# Altium schematic sheet External interfaces and connections.SchDoc
size A4; SheetNumber: 10; SheetTotal: 10
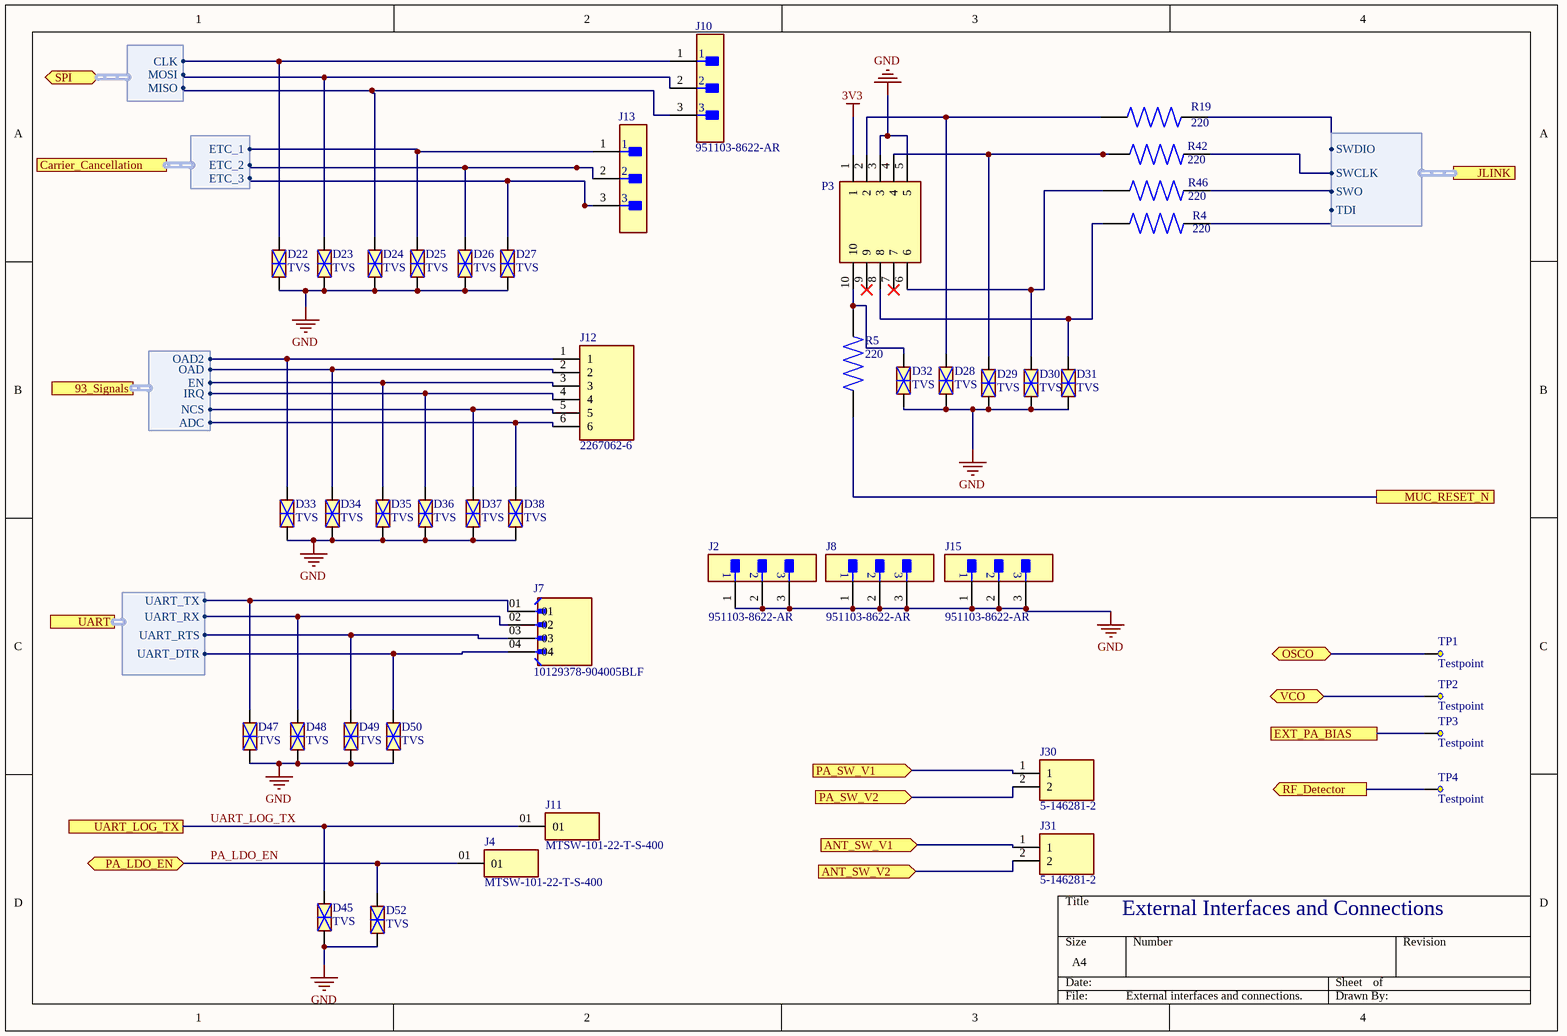
[diagram p0: External interfaces and connections.SchDoc]

## Parts
D22  TVS  [ST0201]
D23  TVS  [ST0201]
D24  TVS  [ST0201]
D25  TVS  [ST0201]
D26  TVS  [ST0201]
D27  TVS  [ST0201]
D28  TVS  [ST0201]
D29  TVS  [ST0201]
D30  TVS  [ST0201]
D31  TVS  [ST0201]
D32  TVS  [ST0201]
D33  TVS  [ST0201]
D34  TVS  [ST0201]
D35  TVS  [ST0201]
D36  TVS  [ST0201]
D37  TVS  [ST0201]
D38  TVS  [ST0201]
D45  TVS  [ST0201]
D47  TVS  [ST0201]
D48  TVS  [ST0201]
D49  TVS  [ST0201]
D50  TVS  [ST0201]
D52  TVS  [ST0201]
J2  951103-8622-AR  [FP-951103-8622-AR-MFG]
J4  MTSW-101-22-T-S-400  [SAMTEC_MTSW-101-22-T-S-400]
J7  10129378-904005BLF  [AMPHENOL_10129378-904005BLF]
J8  951103-8622-AR  [FP-951103-8622-AR-MFG]
J10  951103-8622-AR  [FP-951103-8622-AR-MFG]
J11  MTSW-101-22-T-S-400  [SAMTEC_MTSW-101-22-T-S-400]
J12  2267062-6  [TE_2267062-6]
J13  951103-8622-AR  [FP-951103-8622-AR-MFG]  (value not drawn)
J15  951103-8622-AR  [FP-951103-8622-AR-MFG]
J30  5-146281-2  [TE_5-146281-2]
J31  5-146281-2  [TE_5-146281-2]
P3  .06.04_J-LINK_NEEDLE_ADAPTER  [SEGGER_8.06.04_J-LINK_NEEDLE_ADAPTER]  (value not drawn)
R4  220  [RESC1005X40N]
R5  220  [RESC1005X40N]
R19  220  [RESC1005X40N]
R42  220  [RESC1005X40N]
R46  220  [RESC1005X40N]
TP1  Testpoint  [Testpoint_FP]
TP2  Testpoint  [Testpoint_FP]
TP3  Testpoint  [Testpoint_FP]
TP4  Testpoint  [Testpoint_FP]

## Ports
93_Signals (harness 93_Signals, see System Overview[1B], Microcontroller[4A], UHF RFID READER IC[1A]), ANT_SW_V1 (in, see System Overview[1D], Antenna Switch[2B], Microcontroller[1C]), ANT_SW_V2 (in, see System Overview[1D], Antenna Switch[2B], Microcontroller[1C]), Carrier_Cancellation (harness Carrier_Cancellation, see System Overview[1B], Carrier Cancellation Circuit[1A], Microcontroller[4B]), EXT_PA_BIAS (see System Overview[1C], External Power Amplifier[1C]), JLINK (harness JLINK, see System Overview[1C], Microcontroller[1B]), MUC_RESET_N (see System Overview[1C], Microcontroller[3B]), OSCO (bidir, see System Overview[1C], UHF RFID READER IC[1B]), PA_LDO_EN (bidir, see System Overview[1C], Microcontroller[1B], Supply LDOs[2C]), PA_SW_V1 (in, see System Overview[1C], External Power Amplifier[4A], Microcontroller[1B]), PA_SW_V2 (in, see System Overview[1C], External Power Amplifier[4A], Microcontroller[3A]), RF_Detector (out, see System Overview[1C], External Power Amplifier[3D], Microcontroller[2A]), SPI (bidir, harness SPI, see System Overview[1B], Carrier Cancellation Circuit[1A], Microcontroller[4A], UHF RFID READER IC[1A]), UART (harness UART, see System Overview[1C], Microcontroller[1A], USB suply_UART bridge[4D]), UART_LOG_TX (see System Overview[1C], Microcontroller[4A]), VCO (bidir, see System Overview[1C], UHF RFID READER IC[1B])

## Harnesses
93_Signals: EN, IRQ, NCS, ADC, OAD, OAD2
Carrier_Cancellation: ETC_1, ETC_2, ETC_3
SPI: CLK, MISO, MOSI
UART: UART_TX, UART_RX, UART_RTS, UART_DTR
JLINK: SWDIO, SWCLK, SWO, TDI

## Nets
3V3: P3.1
GND: D22.2 D23.2 D24.2 D25.2 D26.2 D27.2 D28.2 D29.1 D29.2 D30.2 D31.2 D32.2 D33.2 D34.2 D35.2 D36.2 D37.2 D38.2 D45.2 D47.2 D48.2 D49.2 D50.2 D52.2 J2.1 J2.2 J2.3 J8.1 J8.2 J8.3 J15.1 J15.2 J15.3 P3.3 P3.4 P3.5 R42.1
ANT_SW_V1: J31.1 ; port ANT_SW_V1
ANT_SW_V2: J31.2 ; port ANT_SW_V2
EXT_PA_BIAS: TP3.TP?(Testpoint) ; port EXT_PA_BIAS
MUC_RESET_N: R5.1 ; port MUC_RESET_N
OSCO: TP1.TP?(Testpoint) ; port OSCO
PA_LDO_EN: D52.1 J4.01 ; port PA_LDO_EN
PA_SW_V1: J30.1 ; port PA_SW_V1
PA_SW_V2: J30.2 ; port PA_SW_V2
RF_Detector: TP4.TP?(Testpoint) ; port RF_Detector
UART_LOG_TX: D45.1 J11.01 ; port UART_LOG_TX
VCO: TP2.TP?(Testpoint) ; port VCO
NetD22_1: D22.1 J10.1 ; port SPI.CLK
NetD23_1: D23.1 J10.2 ; port SPI.MOSI
NetD24_1: D24.1 J10.3 ; port SPI.MISO
NetD25_1: D25.1 J13.1 ; port Carrier_Cancellation.ETC_1
NetD26_1: D26.1 J13.2 ; port Carrier_Cancellation.ETC_2
NetD27_1: D27.1 J13.3 ; port Carrier_Cancellation.ETC_3
NetD28_1: D28.1 P3.2 R19.1
NetD30_1: D30.1 P3.6 R46.1
NetD31_1: D31.1 P3.8 R4.1
NetD32_1: D32.1 P3.10 R5.2
NetD33_1: D33.1 J12.1 ; port 93_Signals.OAD2
NetD34_1: D34.1 J12.2 ; port 93_Signals.OAD
NetD35_1: D35.1 J12.3 ; port 93_Signals.EN
NetD36_1: D36.1 J12.4 ; port 93_Signals.IRQ
NetD37_1: D37.1 J12.5 ; port 93_Signals.NCS
NetD38_1: D38.1 J12.6 ; port 93_Signals.ADC
NetD47_1: D47.1 J7.01 ; port UART.UART_TX
NetD48_1: D48.1 J7.02 ; port UART.UART_RX
NetD49_1: D49.1 J7.03 ; port UART.UART_RTS
NetD50_1: D50.1 J7.04 ; port UART.UART_DTR
NetR4_2: R4.2 ; port JLINK.TDI
NetR19_2: R19.2 ; port JLINK.SWDIO
NetR42_2: R42.2 ; port JLINK.SWCLK
NetR46_2: R46.2 ; port JLINK.SWO

Not connected (* = marked no-connect by the designer): P3 7* 9*

## Notes on the sheet
- External Interfaces and Connections

## Library data of the parts
D22-D38 D45 D47-D50 D52 = ESDAXLC6-1BU2: 17V Clamp 1A (8/20Âµs) Ipp Tvs Diode Surface Mount ST0201; MF: STMicroelectronics; SnapEDA_Link: https://www.snapeda.com/parts/ESDAXLC6-1BU2/STMicroelectronics/view-part/?ref=snap; Package: 0201 STMicroelectronics; Value: *; MP: ESDAXLC6-1BU2; Check_prices: https://www.snapeda.com/parts/ESDAXLC6-1BU2/STMicroelectronics/view-part/?ref=eda
J2 J8 J10 J13 J15 = CMP-05379-000003-1: CONN HEADER VERT 3POS 2MM; Manufacturer: 3M; Conn Gender: Male; Current Rating: 2A; Number Of Contacts: 3; Conn Orientation: Straight; Digikey Description: CONN HEADER VERT 3POS 2MM; Device Class L3: unset; Category: Conn; Height: 6.3mm; Manufacturer Part Number: 951103-8622-AR; RoHS: TRUE; Contact Material: Gold,Nickel; ComponentLink2Description: Datasheet; Temperature Range Low: -55°C; Device Class L1: Connectors; Pitch: 2mm; Mouser Description: Header; PinStrip; CopperAlloy; HighTempThermoplastic; 3Cnts; 1A; RtAngle; 951Series; Octopart: https://octopart.com/951103-8622-ar-3m-14400669; Package: 951103-8622-AR; Lead Free: Yes; Device Class L2: Headers and Wire Housings; Temperature Range High: +125°C; ComponentLink2URL: http://multimedia.3m.com/mws/media/1400506O/3m-pin-strip-header-951-series-78-5100-2653-3.pdf; Automotive: No; Temperature: -55°C to +125°C; Number Of Rows: 1
J4 J11 = MTSW-101-22-T-S-400: Connector Header Through Hole 1 position; MF: Samtec; Check_prices: https://www.snapeda.com/parts/MTSW-101-22-T-S-400/Samtec/view-part/?ref=eda; Purchase-URL: https://pricing.snapeda.com/search/part/MTSW-101-22-T-S-400/?ref=eda; SnapEDA_Link: https://www.snapeda.com/parts/MTSW-101-22-T-S-400/Samtec/view-part/?ref=snap; Price: None; Value: *; MP: MTSW-101-22-T-S-400; Package: None; Availability: In Stock
J7 = 10129378-904005BLF: Headers & Wire Housings 10129378-904005BLF-HEADER SR VT TH 1*4; MF: Amphenol; Package: None; Value: *; Check_prices: https://www.snapeda.com/parts/10129378-904005BLF/Amphenol/view-part/?ref=eda; SnapEDA_Link: https://www.snapeda.com/parts/10129378-904005BLF/Amphenol/view-part/?ref=snap; Availability: In Stock; Purchase-URL: https://pricing.snapeda.com/search/part/10129378-904005BLF/?ref=eda; MP: 10129378-904005BLF; Price: None
J30 J31 = 5-146281-2: Header; Breakaway; 0.100 in.; PC Board; Single; 2; 0.025 in.; 0.12 in.; 3 A; MF: TE Connectivity; Number_of_Positions: 2; Centerline_Pitch: 2.54 mm[.1 in]; Product_Type: Connector; EU_RoHS_Compliance: Compliant; SnapEDA_Link: https://www.snapeda.com/parts/5-146281-2/TE%20Connectivity%20AMP%20Connectors/view-part/457165/?ref=snap; Price: None; MP: 5-146281-2; Package: None; Value: *; Availability: Unavailable
P3 = 8.06.04_J-LINK_NEEDLE_ADAPTER: J-LINK 10-PIN NEEDLE ADAPTER; MF: Segger Microcontroller; MP: 8.06.04 J-LINK NEEDLE ADAPTER; Package: None; Value: *; Availability: No availability data; Check_prices: https://www.snapeda.com/parts/8.06.04%20J-LINK%20NEEDLE%20ADAPTER/Segger%20Microcontroller%20Systems/view-part/2780259/?ref=eda; Price: None; SnapEDA_Link: https://www.snapeda.com/parts/8.06.04%20J-LINK%20NEEDLE%20ADAPTER/Segger%20Microcontroller%20Systems/view-part/2780259/?ref=snap
R4 R5 R19 R42 R46 = RC0402JR-07220RL: 220 Ohms ±5% 0.063W, 1/16W Chip Resistor 0402 (1005 Metric) Moisture Resistant Thick Film; MF: Yageo; SnapEDA_Link: https://www.snapeda.com/parts/RC0402JR-07220RL/Yageo/view-part/?ref=snap; Package: 1005 Panasonic Electronic Components; Value: *; MP: RC0402JR-07220RL; Check_prices: https://www.snapeda.com/parts/RC0402JR-07220RL/Yageo/view-part/?ref=eda
J12 = 2267062-6: Package: None; Price: None; Value: *; MP: 2267062-6; Availability: Unavailable